# EasyEDA schematic CoopCommand-Control Panel_2020-07-27_09-00-06.json
TITLE: Coop Command - Control Panel; REV: 1.1; Date: 2020-07-16; Sheet: 1/1; Drawn By: hms11; Company: Your Company
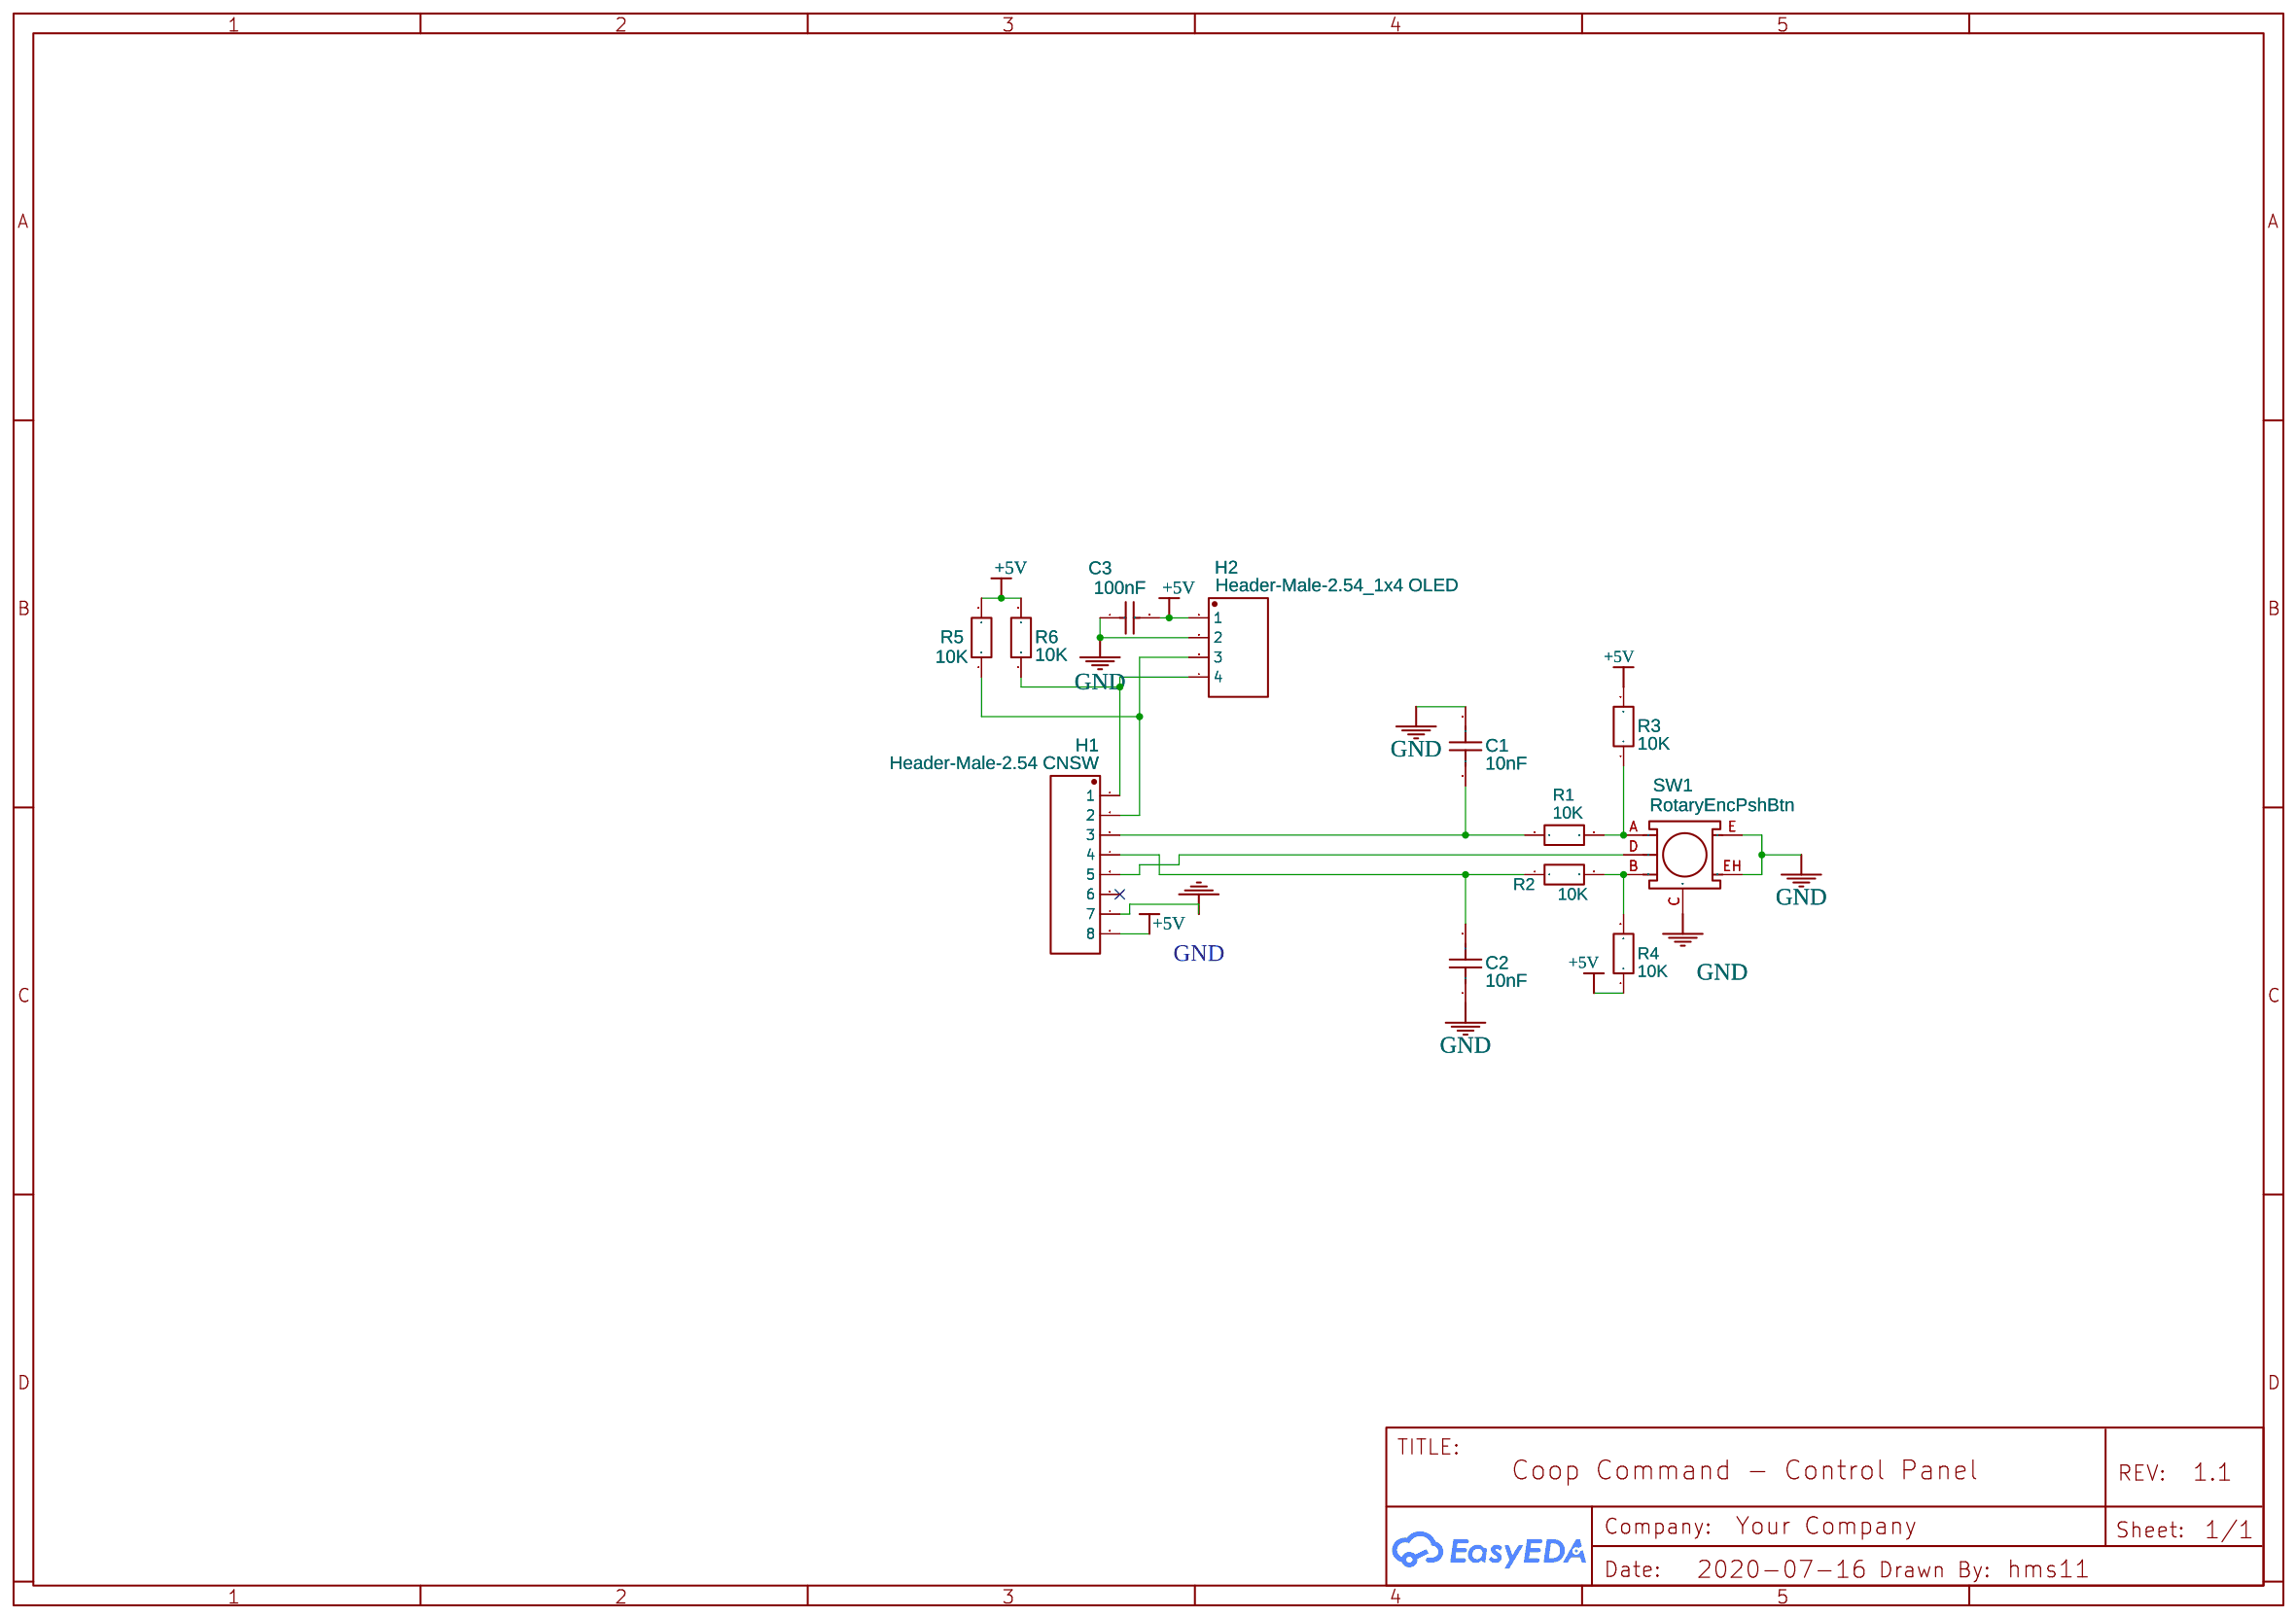
[diagram p0: schematic sheet]

## Parts
C1  10nF  [CAP-TH_L5.0-W2.5-P2.54-D0.7]
C2  10nF  [CAP-TH_L5.0-W2.5-P2.54-D0.7]
C3  100nF  [CAP-TH_L5.0-W2.5-P2.54-D0.7]
H1  Header-Male-2.54 CNSW  [HDR-TH_8P-P2.54-V-M]
H2  Header-Male-2.54_1x4 OLED  [HDR-TH_4P-P2.54-V]
R1  10K  [RES-TH_BD2.4-L6.3-P10.30-D0.6]
R2  10K  [RES-TH_BD2.4-L6.3-P10.30-D0.6]
R3  10K  [RES-TH_BD2.4-L6.3-P10.30-D0.6]
R4  10K  [RES-TH_BD2.4-L6.3-P10.30-D0.6]
R5  10K  [RES-TH_BD2.4-L6.3-P10.30-D0.6]
R6  10K  [RES-TH_BD2.4-L6.3-P10.30-D0.6]
SW1  RotaryEncPshBtn  [SW-TH_ EC11M1565403]

## Library data of the parts
C1 C2 = CC1H103ZA1AD3F4D10MF: Supplier: LCSC; Supplier Part: C254082; Manufacturer: Dersonic; Contributor: LCSC
C3 = CS1F5.6Y5V1A104Z: Supplier: LCSC; Manufacturer: ReliaPro; Supplier Part: C9306
H1 = Header-Male-2.54_1x8: Supplier: LCSC; Manufacturer: Ckmtw; Manufacturer Part: 210S-1*8P L=11.6MMGold-plated black; Contributor: LCSC; Supplier Part: C124381
H2 = Header-Male-2.54_1x4: Supplier: LCSC; Manufacturer: Ckmtw; Manufacturer Part: 210S-1*4P L=11.6MMGold-plated black; Contributor: LCSC; Supplier Part: C124378; Package Display: No
R1-R6 = RN 1/4W 10K F T/B A1: Supplier: LCSC; Supplier Part: C410695; Manufacturer: TyoHM; Contributor: LCSC
SW1 = EC11G1560414: Supplier: LCSC; Supplier Part: C470719; Manufacturer: ALPS Electric; Contributor: LCSC; Package Display: No

## Nets
+5V: C3.2 H1.8 H2.1 R3.2 R4.1 R5.2 R6.2
GND: C1.2 C2.1 C3.1 H1.7 H2.2 SW1.C SW1.E SW1.EH
Net-(C1-1): C1.1 H1.3 R1.1
Net-(C2-2): C2.2 H1.4 R2.1
Net-(H1-1): H1.1 H2.4 R6.1
Net-(H1-2): H1.2 H2.3 R5.1
Net-(H1-5): H1.5 SW1.D
Net-(R1-2): R1.2 R3.1 SW1.A
Net-(R2-2): R2.2 R4.2 SW1.B

Not connected (* = marked no-connect by the designer): H1 6*
